# Altium schematic sheet 1.SchDoc
size 594 x 420 mm
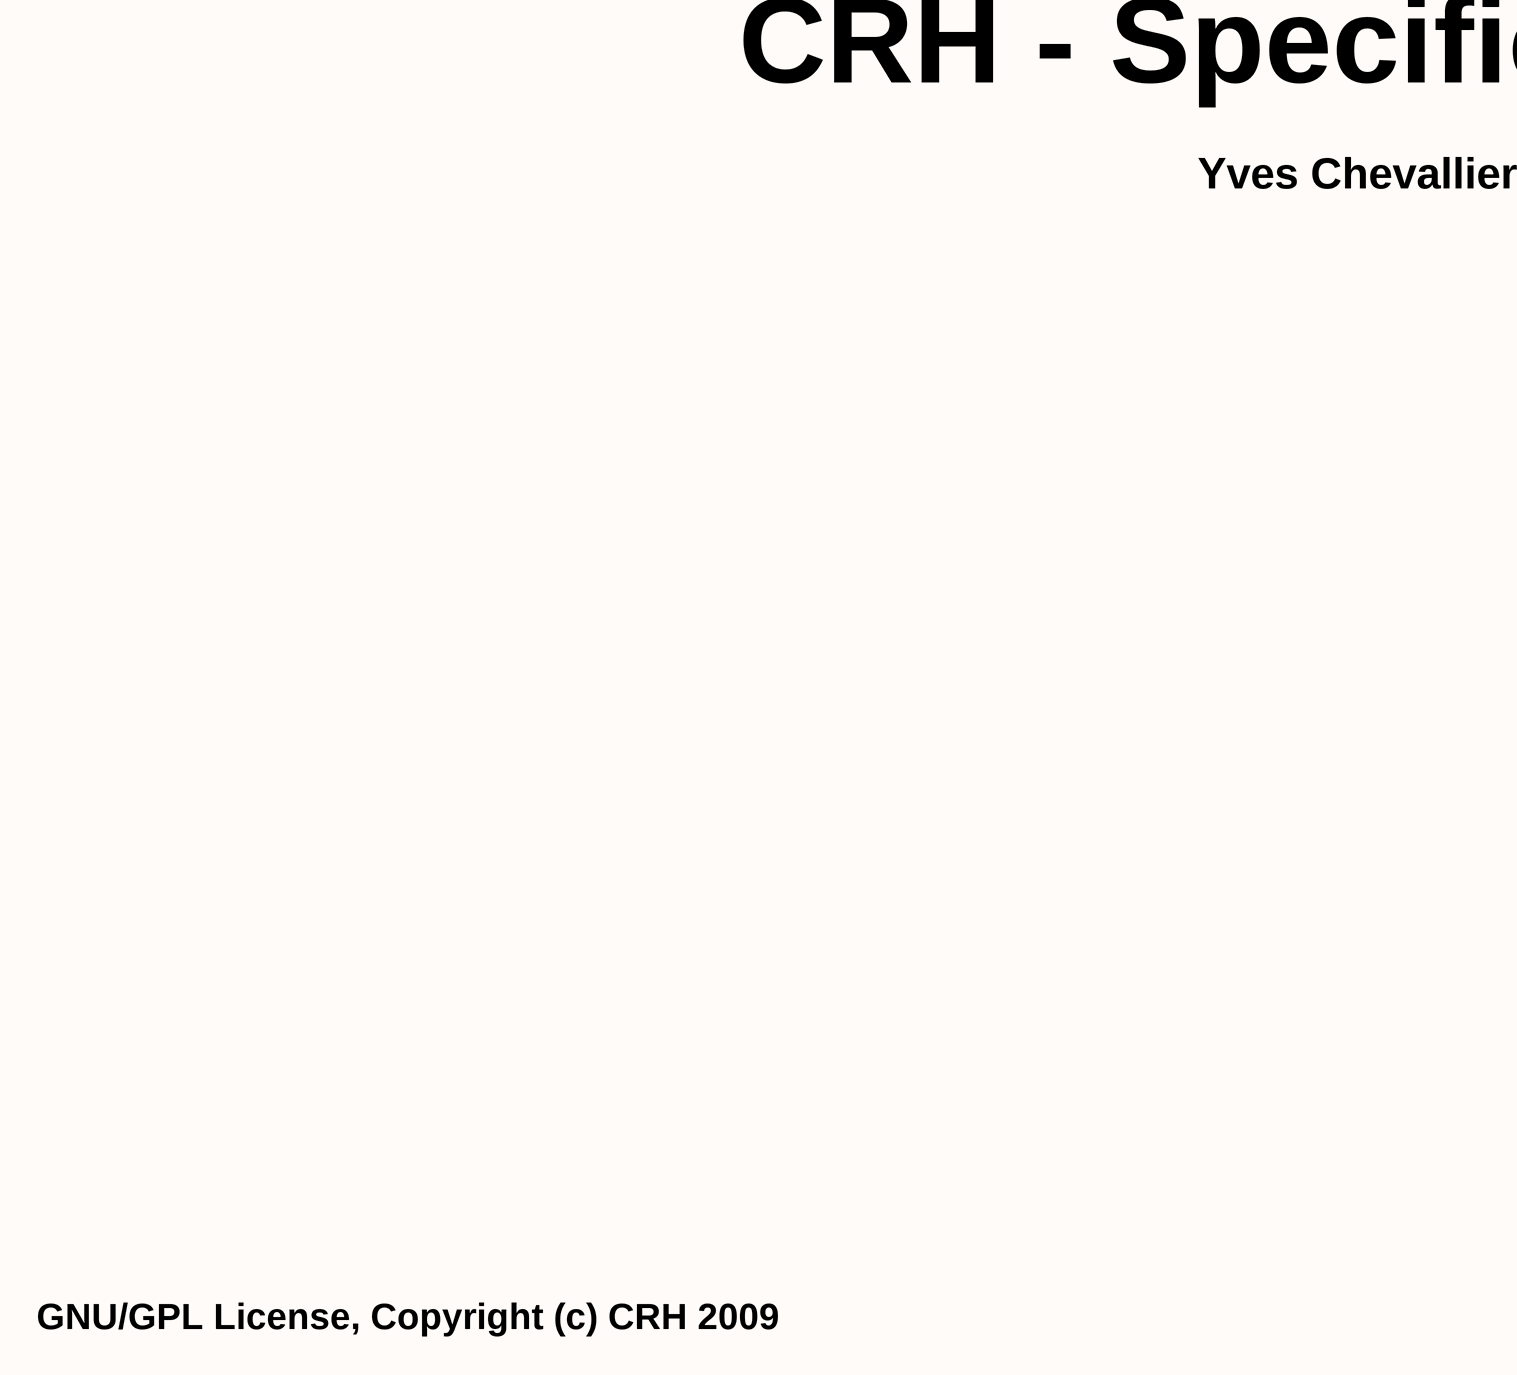
[diagram p0: 1.SchDoc, left]
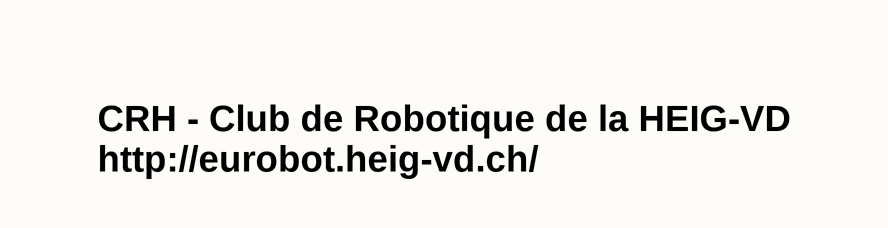
[diagram p1: 1.SchDoc, right]

## Notes on the sheet
- CRH - Specific board 2009
- Yves Chevallier - 31 Janvier 2009
- CRH - Club de Robotique de la HEIG-VD
  http://eurobot.heig-vd.ch/
- GNU/GPL License, Copyright (c) CRH 2009